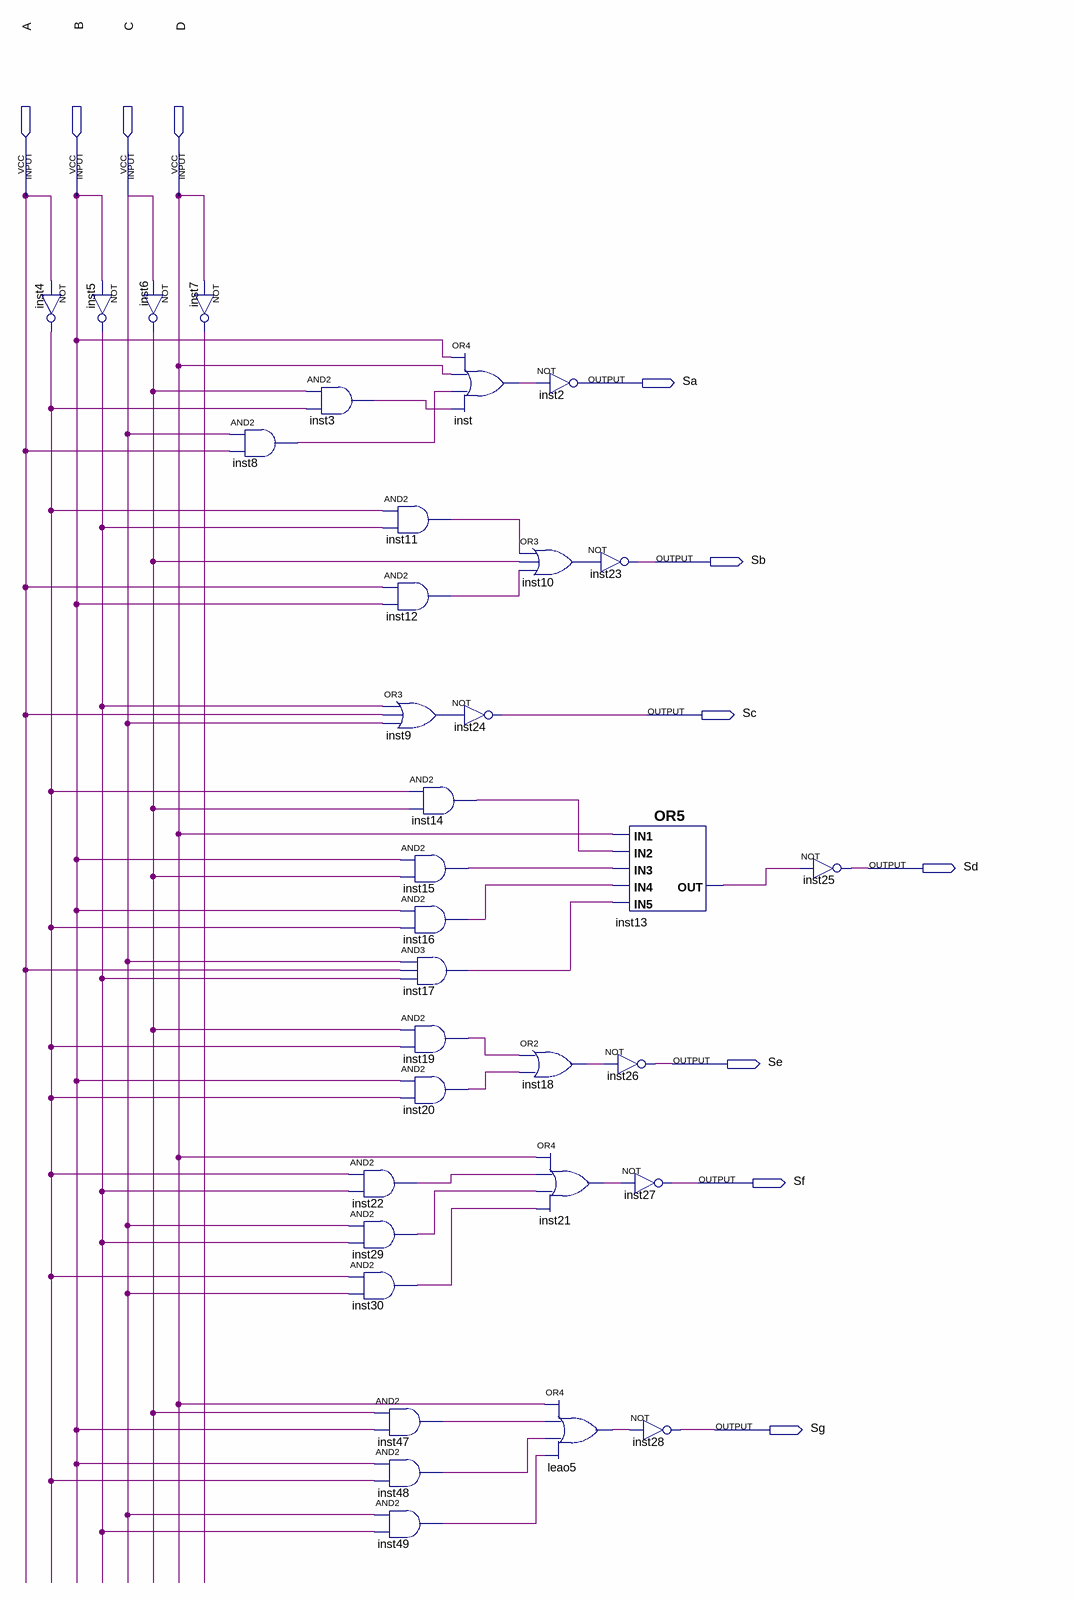
[diagram p0: schematic sheet]
// Quartus schematic Clock.bdf as structural Verilog: 34 symbols, 11 pins
module Clock (
  input  A,
  input  B,
  input  C,
  input  D,
  output Sa,
  output Sb,
  output Sc,
  output Sd,
  output Se,
  output Sf,
  output Sg
);

  wire inst3_out, inst4_out, inst5_out, inst6_out, inst7_out, inst8_out, inst9_out, inst10_out, inst11_out,
       inst12_out, inst13_out, inst14_out, inst15_out, inst16_out, inst17_out, inst18_out, inst19_out,
       inst20_out, inst21_out, inst22_out, inst29_out, inst30_out, inst47_out, inst48_out, inst49_out,
       inst_out, leao5_out;

  not inst4 (inst4_out, A);
  not inst5 (inst5_out, B);
  not inst7 (inst7_out, D);
  not inst6 (inst6_out, C);
  and inst8 (inst8_out, C, A);
  and inst3 (inst3_out, inst6_out, inst4_out);
  and inst11 (inst11_out, inst4_out, inst5_out);
  and inst12 (inst12_out, A, B);
  or inst9 (inst9_out, inst5_out, A, C);
  and inst15 (inst15_out, B, inst6_out);
  and inst16 (inst16_out, B, inst4_out);
  and inst17 (inst17_out, C, A, inst5_out);
  and inst19 (inst19_out, inst6_out, inst4_out);
  and inst20 (inst20_out, B, inst4_out);
  and inst22 (inst22_out, inst4_out, inst5_out);
  and inst29 (inst29_out, C, inst5_out);
  and inst30 (inst30_out, inst4_out, C);
  and inst47 (inst47_out, inst6_out, B);
  and inst48 (inst48_out, B, inst4_out);
  and inst49 (inst49_out, C, inst5_out);
  or inst (inst_out, B, D, inst8_out, inst3_out);
  not inst24 (Sc, inst9_out);
  and inst14 (inst14_out, inst4_out, inst6_out);
  not inst2 (Sa, inst_out);
  or inst10 (inst10_out, inst11_out, inst6_out, inst12_out);
  or inst18 (inst18_out, inst19_out, inst20_out);
  or inst21 (inst21_out, D, inst22_out, inst29_out, inst30_out);
  not inst23 (Sb, inst10_out);
  not inst26 (Se, inst18_out);
  or leao5 (leao5_out, D, inst47_out, inst48_out, inst49_out);
  or inst13 (inst13_out, D, inst14_out, inst15_out, inst16_out, inst17_out);
  not inst27 (Sf, inst21_out);
  not inst28 (Sg, leao5_out);
  not inst25 (Sd, inst13_out);
endmodule
